# EAGLE schematic EXCISS HVU (EAGLE 7.7.0)

## Sheet 1 of 2
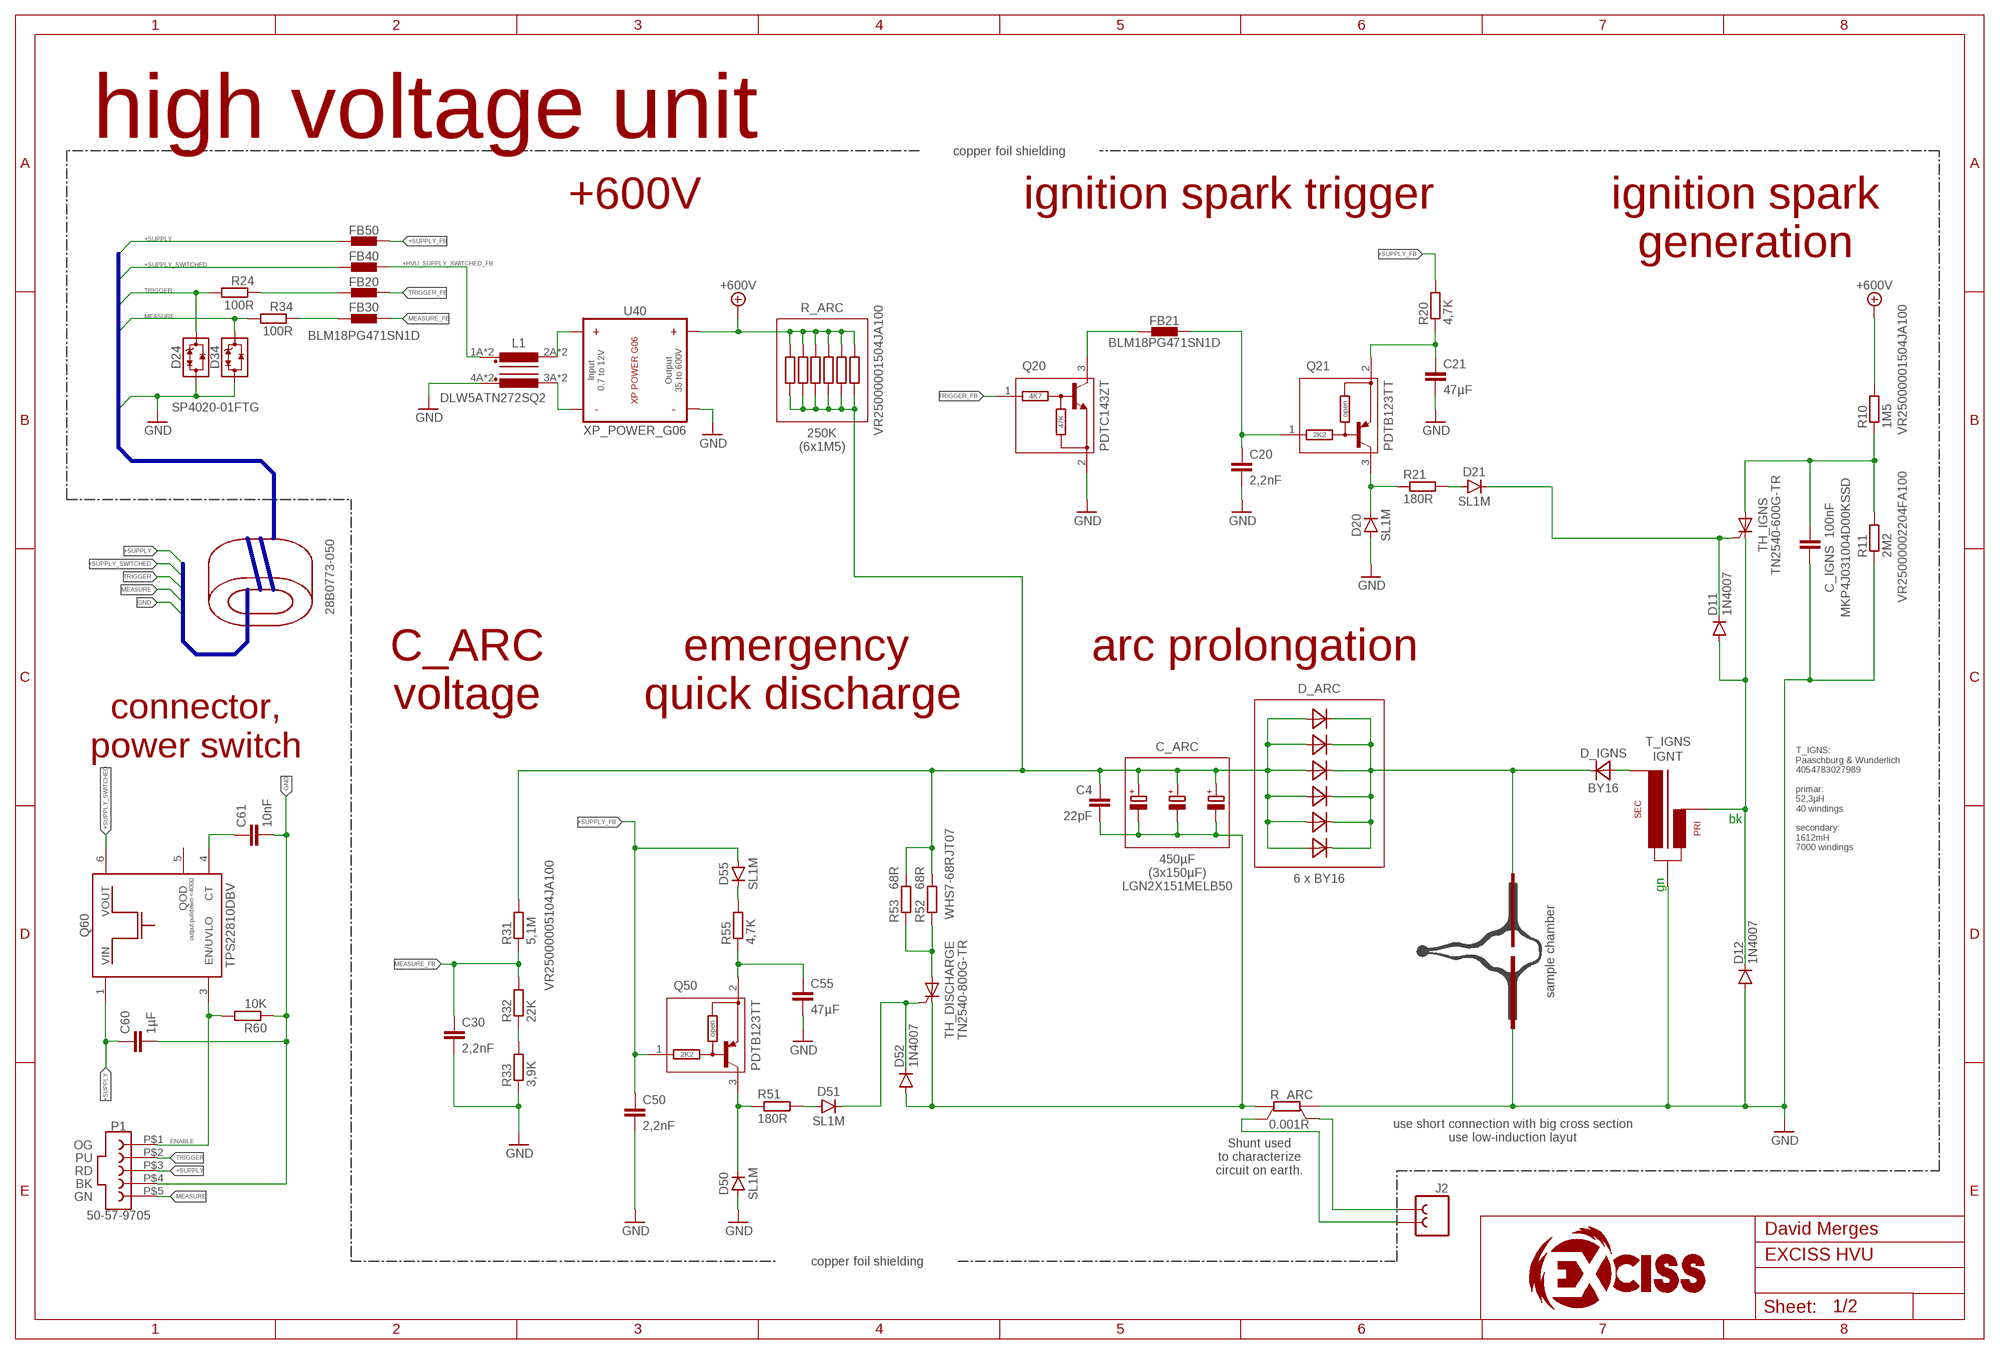
[diagram p0: schematic, sheet 1]

### Parts
C4  22pF  C-EUC0805  [C0805]
C20  2,2nF  C-EUC0805  [C0805]
C21  47µF  C-EUC1206  [C1206]
C30  2,2nF  C-EUC0805  [C0805]
C50  2,2nF  C-EUC0805  [C0805]
C55  47µF  C-EUC1206  [C1206]
C60  1µF  C-EUC0805  [C0805]
C61  10nF  C-EUC0603  [C0603]
C_ARC1  150µF  CPOL-EU140CLH-1010  [140CLH-1010]
C_ARC2  150µF  CPOL-EU140CLH-1010  [140CLH-1010]
C_ARC3  150µF  CPOL-EU140CLH-1010  [140CLH-1010]
C_IGNS  100nF  C-EU025-024X044  [C025-024X044]
D11  1N4007  [DO41-10]
D12  1N4007  [DO41-10]
D20  SL1M  [SOD-123FL]
D21  SL1M  [SOD-123FL]
D24  SP4020-01FTG  [SOD-323]
D34  SP4020-01FTG  [SOD-323]
D50  SL1M  [SOD-123FL]
D51  SL1M  [SOD-123FL]
D52  1N4007  [DO41-10]
D55  SL1M  [SOD-123FL]
D_ARC1  BY16  [BY16]
D_ARC2  BY16  [BY16]
D_ARC3  BY16  [BY16]
D_ARC4  BY16  [BY16]
D_ARC5  BY16  [BY16]
D_ARC6  BY16  [BY16]
D_IGNS  BY16  [BY16]
FB20  BLM18PG471SN1D  BLM15HB121SN1  [0402]
FB21  BLM18PG471SN1D  BLM15HB121SN1  [0402]
FB30  BLM18PG471SN1D  BLM15HB121SN1  [0402]
FB40  BLM18PG471SN1D  BLM15HB121SN1  [0402]
FB50  BLM18PG471SN1D  BLM15HB121SN1  [0402]
J2  F02  [1X02]
L1  DLW5ATN272SQ2  [DLW5AT]
P1  50-57-9705  14-56-2054  [DUMMY]
Q20  PDTC143ZT  [SOT23-3]
Q21  PDTB123TT  [SOT23-3]
Q50  PDTB123TT  [SOT23-3]
Q60  TPS22810DBV  [SOT23-6_DBV]
R10  1M5  R-EU_0204/7  [0204/7]
R11  2M2  R-EU_0204/7  [0204/7]
R20  4,7K  R-EU_R0603  [R0603]
R21  180R  R-EU_R0603  [R0603]
R24  100R  R-EU_R0603  [R0603]
R31  5,1M  R-EU_0204/7  [0204/7]
R32  22K  R-EU_0204/7  [0204/7]
R33  3,9K  R-EU_0204/7  [0204/7]
R34  100R  R-EU_R0603  [R0603]
R51  180R  R-EU_R0603  [R0603]
R52  68R  R-EU_0204/7  [0204/7]
R53  68R  R-EU_0204/7  [0204/7]
R55  4,7K  R-EU_R0603  [R0603]
R60  10K  R-EU_R0805  [R0805]
R_ARC  0.001R  SMV  [SMV]
R_ARC1  1,5M  R-EU_0204/7  [0204/7]
R_ARC2  1,5M  R-EU_0204/7  [0204/7]
R_ARC3  1,5M  R-EU_0204/7  [0204/7]
R_ARC4  1,5M  R-EU_0204/7  [0204/7]
R_ARC5  1,5M  R-EU_0204/7  [0204/7]
R_ARC6  1,5M  R-EU_0204/7  [0204/7]
T_IGNS  IGNT  [DUMMY]
TH_DISCHARGE  TN2540-800G-TR  TN2540-600G-TR  [D2PACK]
TH_IGNS  TN2540-600G-TR  [D2PACK]
U40  XP_POWER_G06  [XP_POWER_G06]
U$2  PROBENKAMMER  [DUMMY]

### Nets
+600V: R10.2 R_ARC1.2 R_ARC2.2 R_ARC3.2 R_ARC4.2 R_ARC5.2 R_ARC6.2 U40.3(+VOUT)
+HVU_SUPPLY_SWITCHED_FB: FB40.2 L1.1A L1.1B+
+SUPPLY: C60.1 FB50.1 P1.P$3 Q60.1(VIN)
+SUPPLY_FB: C50.1 D55.A FB50.2 Q50.1(B) R20.2
+SUPPLY_SWITCHED: FB40.1 Q60.6(VOUT)
ENABLE: P1.P$1 Q60.3(EN/UVLO) R60.2
GND: C20.2 C21.2 C30.2 C50.2 C55.2 C60.2 C61.2 C_IGNS.2 D12.A D20.A D24.A D34.A D50.A L1.4A L1.4B P1.P$4 Q20.2(E) R11.1 R33.1 R60.1 R_ARC.I1(A) T_IGNS.P$1(COM) U40.4(-VOUT) U$2.P$1
MEASURE: D34.C P1.P$5 R34.2
MEASURE_FB: C30.1 FB30.2 R31.1 R32.2
N$1: C_IGNS.1 R10.1 R11.2 TH_IGNS.2(A)
N$2: D20.C Q21.3(C) R21.1
N$3: D_ARC1.C D_ARC2.C D_ARC3.C D_ARC4.C D_ARC5.C D_ARC6.C D_IGNS.C U$2.P$2
N$4: R32.1 R33.2
N$5: D11.A D12.C T_IGNS.P$2(PRI) TH_IGNS.1(C)
N$6: D_IGNS.A T_IGNS.P$3(SEC)
N$7: C21.1 Q21.2(E) R20.1
N$8: R52.1 R53.1 TH_DISCHARGE.2(A)
N$9: D21.A R21.2
N$10: D11.C D21.C TH_IGNS.3(G)
N$11: L1.3A L1.3B U40.2(-VIN)
N$12: C4.2 C_ARC1.- C_ARC2.- C_ARC3.- D52.A R_ARC.I2(B) TH_DISCHARGE.1(C)
N$13: C20.1 FB21.2 Q21.1(B)
N$14: C61.1 Q60.4(CT)
N$15: J2.2 R_ARC.U1(SA)
N$16: D51.C D52.C TH_DISCHARGE.3(G)
N$17: J2.1 R_ARC.U2(SB)
N$18: FB21.1 Q20.3(C)
N$19: L1.2A L1.2B U40.1(+VIN)
N$20: D51.A R51.2
N$21: FB30.1 R34.1
N$22: FB20.1 R24.1
N$23: D50.C Q50.3(C) R51.1
N$24: C55.1 Q50.2(E) R55.1
N$25: D55.C R55.2
TRIGGER: D24.C P1.P$2 R24.2
TRIGGER_FB: FB20.2 Q20.1(B)
V_ARC: C4.1 C_ARC1.+ C_ARC2.+ C_ARC3.+ D_ARC1.A D_ARC2.A D_ARC3.A D_ARC4.A D_ARC5.A D_ARC6.A R31.2 R52.2 R53.2 R_ARC1.1 R_ARC2.1 R_ARC3.1 R_ARC4.1 R_ARC5.1 R_ARC6.1
Unconnected: Q60.5(QOD)

### Buses
+SUPPLY,+SUPPLY_SWITCHED,TRIGGER,MEASURE,GND

### Notes on the sheet
- high voltage unit
- copper foil shielding
- +600V | ignition spark trigger
- ignition spark
  generation
- R_ARC
- VR25000001504JA100
- 250K
  (6x1M5)
- VR25000001504JA100
- VR25000002204FA100
- MKP4J031004D00KSSD
- 28B0773-050
- C_ARC
  voltage
- emergency 
  quick discharge
- arc prolongation
- connector,
  power switch
- D_ARC
- T_IGNS:
  Paaschburg & Wunderlich
  4054783027989
  
  primar: 
  52,3µH
  40 windings
  
  secondary: 
  1612mH
  7000 windings
- C_ARC
- bk
- 450µF
  (3x150µF)
  LGN2X151MELB50
- WHS7-68RJT07 | 6 x BY16
- gn
- VR25000005104JA100
- sample chamber
- use short connection with big cross section
  use low-induction layut
- Shunt used 
  to characterize 
  circuit on earth.
- OG
- PU
- RD
- BK
- GN
- copper foil shielding

## Sheet 2 of 2

## Power pins joined to a net without a drawn wire
GND: Q60.2(GND)

## Library data of the parts
C4 C20 C21 C30 C50 C55 C60 C61 C_IGNS = rcl:C-EU: CAPACITOR, European symbol
C_ARC1-C_ARC3 = rcl:CPOL-EU: POLARIZED CAPACITOR, European symbol
D11 D12 D52 = exciss:1N4007: 1N4007 Standard Recovery Rectifier Diodes Links Datasheet <https://diotec.com/tl_files/diotec/files/pdf/datasheets/1n4001>
D20 D21 D50 D51 D55 = exciss:SL1: SL1A ... SL1M SHORT_DESCRIPTION Links Datasheet <https://diotec.com/tl_files/diotec/files/pdf/datasheets/sl1a>; OC_CONRAD: 556838 - 62
D24 D34 = exciss:SP4020-01FTG: SP4020-01FTG Lightning Surge Protection- SP4020 Series SP4020 Series 2.5pF, 30A Discrete TVS Diode Links Datasheet <http://www.littelfuse.com/~/media/electronics/datasheets/tvs_diode_arrays/littelfuse_tvs_diode_array_sp4020_datasheet.pdf.pdf> Product website <http://www.littelfuse.com/products/tvs-diode-arrays/lightning-surge-protection/sp4020/sp4020_01ftg.aspx>; OC_MOUSER: 576-SP4020-01FTG
D_ARC1-D_ARC6 D_IGNS = exciss:BY16: BY16 Standard Recovery High Voltage Rectifier Diodes Links Datasheet <https://diotec.com/tl_files/diotec/files/pdf/datasheets/by4.pdf>
FB20 FB21 FB30 FB40 FB50 = inductors:BLM15H: EMIFIL (R) Chip Ferrite Bead for GHz Noise Source: http://www.murata.com/ Ferrite Bead BLM15H.pdf
J2 = MyEagleLibrary:F02
L1 = exciss:DLW5AT: DLW5AT Wire Wound Chip Common Mode Choke Coil Links Datasheet <https://www.murata.com/en-us/products/productdata/8796760571934/EFLC0017.pdf?1466047804000> Product website <https://www.murata.com/products/productdetail?partno=DLW5ATN272SQ2%23>; OC_MOUSER: 81-DLW5ATN272SQ2L
P1 = exciss:14-56-2054: 14-56-2054 2.54mm Pitch SL Insulation Displacement Connector Assembly, Female, Single Row, Version G, Positive Lock, Wire Size 26 AWG, 0.38µm Gold (Au), 5 Circuits Links Datasheet <http://www.molex.com/webdocs/datasheets/pdf/en-us//0014562054_RB_CBL_WR_TRP_CONN.pdf> Product website <http://www.molex.com/molex/products/datasheet.jsp?part=active/0014562054_RB_CBL_WR_TRP_CONN.xml>
Q20 = exciss:PDTC: PDTC... NPN resistor-equipped transistors; 100 mA output current capability Links Datasheet: PDTC114YT <https://assets.nexperia.com/documents/data-sheet/PDTC114Y_SER.pdf> PDTC123JT <https://assets.nexperia.com/documents/data-sheet/PDTC123J_SER.pdf> PDTC143ZT <https://assets.nexperia.com/documents/data-sheet/PDTC143Z_SER.pdf> Product Website: PDTC114YT <https://www.nexperia.com/products/bipolar-transistors/resistor-equipped-transistors-rets/rets-100-ma-single/PDTC114YT.html> PDTC123JT <https://www.nexperia.com/products/bipolar-transistors/resistor-equipped-transistors-rets/rets-100-ma-single/PDTC123JT.html> PDTC143ZT <https://www.nexperia.com/products/bipolar-transistors/resistor-equipped-transistors-rets/rets-100-ma-single/PDTC143ZT.html>; R1: 4K7; R2: 47K
Q21 Q50 = exciss:PDTB: PDTB... PNP resistor-equipped transistors; 500 mA output current capability Links Datasheet: PDTB123TT <https://assets.nexperia.com/documents/data-sheet/PDTB123TT.pdf> Product Website: PDTB123TT <https://www.nexperia.com/products/bipolar-transistors/resistor-equipped-transistors-rets/rets-500-ma-single-double/PDTB123TT.html>; R1: 2K2; R2: open
Q60 = exciss:TPS22810: TPS22810 18V, 3A, 79mΩ Load Switch with Adjustable Rise Time, Adj. Quick Output Discharge, & Thermal Shutdown Links Datasheet <http://www.ti.com/lit/gpn/tps22810> Product website <http://www.ti.com/product/tps22810>; OC_MOUSER: 595-TPS22810DBV
R10 R11 R20 R21 R24 R31-R34 R51-R53 R55 R60 R_ARC1-R_ARC6 = rcl:R-EU_: RESISTOR, European symbol
R_ARC = resistor-shunt:SMV: SMD SHUNT RESISTOR; OC_FARNELL: unknown; OC_NEWARK: unknown
T_IGNS = exciss:IGNT
TH_DISCHARGE TH_IGNS = exciss:TN2540-600G-TR: TN2540-600G-TR Standard 25 A SCR Key Features On-state rms current, IT(RMS)25 A Repetitive peak off-state voltage, VDRM/VRRM 600V Triggering gate current, IGT 40 mA Links Datasheet <http://www.st.com/resource/en/datasheet/tn2540.pdf> Product website <http://www.st.com/en/thyristors-scr-and-ac-switches/tn2540.html>
U40 = exciss:XP_POWER_G06: XP Power G06 Isolated Board Mount DC/DC Converter, 600 V, 2.5 mA Links Datasheet <https://www2.xppower.com/Portals/0/pdfs/SF_G_Series.pdf?ver=2018-10-25-101026-050> Product website <https://www.xppower.com/Product/G-Series>
U$2 = exciss:PROBENKAMMER